# Altium schematic sheet Programer.SchDoc
size A
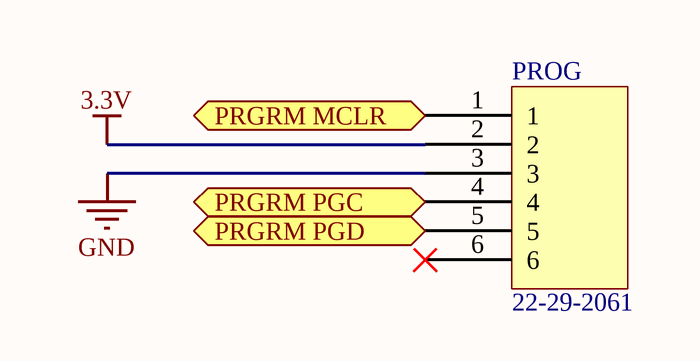
[diagram p0: Programer.SchDoc]

## Parts
PROG  22-29-2061  [HEADER-6-PIN]

## Ports
PRGRM MCLR, PRGRM PGC, PRGRM PGD

## Nets
3.3V: PROG.2
GND: PROG.3
PRGRM MCLR: PROG.1 ; port PRGRM MCLR
PRGRM PGC: PROG.4 ; port PRGRM PGC
PRGRM PGD: PROG.5 ; port PRGRM PGD

Not connected (* = marked no-connect by the designer): PROG 6*

## Library data of the parts
PROG = HEADER-6-PIN